# Altium project VESC_BMS.PrjPcb (part 2 of 2)
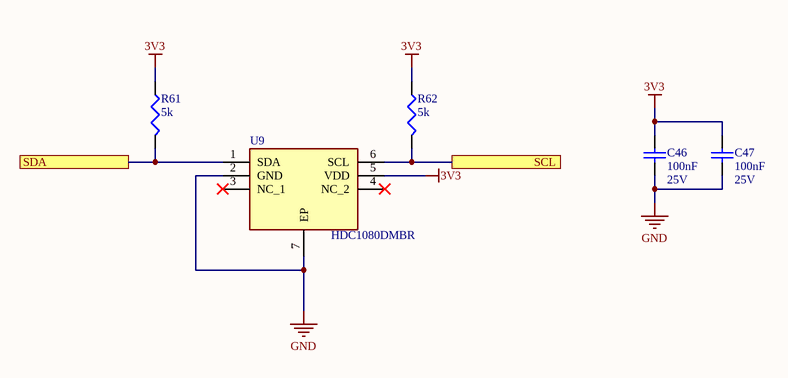
[diagram p9: HDC1080.SchDoc]

## Nets that join several sheets
3V3: BMS_TopLevel (J13.1 R46.1), Controller (15 pins), PowerSwitch (Q8.S R43.2), PowerManagement (C31.1 D3.1 L2.2 R29.2), CAN (C44.2 U7.5), HDC1080 (5 pins)
5V: BMS_TopLevel (Q9.S TP1.1 U6.1), BatteryStackMonitor (C3.1 R4.1 U1.48), PowerSwitch (C40.1 C41.2 IC1.1), PowerManagement (6 pins), CAN (C42.2 C43.2 U7.3), USBSerial (D12.2)
GND: BMS_TopLevel (24 pins), BatteryStackMonitor (19 pins), Battery stack monitor/CELL1 (C45_CELL1.1), Battery stack monitor/CELL2 (C45_CELL2.1), Battery stack monitor/CELL3 (C45_CELL3.1), Battery stack monitor/CELL4 (C45_CELL4.1), Battery stack monitor/CELL5 (C45_CELL5.1), Battery stack monitor/CELL6 (C45_CELL6.1), Battery stack monitor/CELL7 (C45_CELL7.1), Battery stack monitor/CELL8 (C45_CELL8.1), Battery stack monitor/CELL9 (C45_CELL9.1), Battery stack monitor/CELL10 (C45_CELL10.1), Battery stack monitor/CELL11 (C45_CELL11.1), Battery stack monitor/CELL12 (C45_CELL12.1), Battery stack monitor/CELL13 (C45_CELL13.1), Battery stack monitor/CELL14 (C45_CELL14.1), Battery stack monitor/CELL15 (C45_CELL15.1), Battery stack monitor/CELL16 (C45_CELL16.1), Battery stack monitor/CELL17 (C45_CELL17.1), Battery stack monitor/CELL18 (C45_CELL18.1), Controller (17 pins), PowerSwitch (18 pins), PowerManagement (21 pins), CAN (C42.1 C43.1 C44.1 U7.2), USBSerial (7 pins), HDC1080 (C46.1 C47.1 U9.2 U9.7)
BATT+: BMS_TopLevel (J1.1), BatteryStackMonitor (R1.1), PowerSwitch (D7.2 R32.0 R33.0 U5.2), PowerManagement (R20.1)
BT_EN: BMS_TopLevel (R47.1 R48.2), Controller (U2.53)
Buzzer: BMS_TopLevel (Q10.G R52.1), Controller (U2.17)
C1: BatteryStackMonitor (U1.36), Battery stack monitor/CELL1 (C45_CELL1.2 D13_CELL1.2 R58_CELL1.2), Battery stack monitor/CELL2 (D13_CELL2.1)
C2: BatteryStackMonitor (U1.34), Battery stack monitor/CELL2 (C45_CELL2.2 D13_CELL2.2 R58_CELL2.2), Battery stack monitor/CELL3 (D13_CELL3.1)
C3: BatteryStackMonitor (U1.32), Battery stack monitor/CELL3 (C45_CELL3.2 D13_CELL3.2 R58_CELL3.2), Battery stack monitor/CELL4 (D13_CELL4.1)
C4: BatteryStackMonitor (U1.30), Battery stack monitor/CELL4 (C45_CELL4.2 D13_CELL4.2 R58_CELL4.2), Battery stack monitor/CELL5 (D13_CELL5.1)
C5: BatteryStackMonitor (U1.28), Battery stack monitor/CELL5 (C45_CELL5.2 D13_CELL5.2 R58_CELL5.2), Battery stack monitor/CELL6 (D13_CELL6.1)
C6: BatteryStackMonitor (U1.26), Battery stack monitor/CELL6 (C45_CELL6.2 D13_CELL6.2 R58_CELL6.2), Battery stack monitor/CELL7 (D13_CELL7.1)
C7: BatteryStackMonitor (U1.24), Battery stack monitor/CELL7 (C45_CELL7.2 D13_CELL7.2 R58_CELL7.2), Battery stack monitor/CELL8 (D13_CELL8.1)
C8: BatteryStackMonitor (U1.22), Battery stack monitor/CELL8 (C45_CELL8.2 D13_CELL8.2 R58_CELL8.2), Battery stack monitor/CELL9 (D13_CELL9.1)
C9: BatteryStackMonitor (U1.20), Battery stack monitor/CELL9 (C45_CELL9.2 D13_CELL9.2 R58_CELL9.2), Battery stack monitor/CELL10 (D13_CELL10.1)
C10: BatteryStackMonitor (U1.18), Battery stack monitor/CELL10 (C45_CELL10.2 D13_CELL10.2 R58_CELL10.2), Battery stack monitor/CELL11 (D13_CELL11.1)
C11: BatteryStackMonitor (U1.16), Battery stack monitor/CELL11 (C45_CELL11.2 D13_CELL11.2 R58_CELL11.2), Battery stack monitor/CELL12 (D13_CELL12.1)
C12: BatteryStackMonitor (U1.14), Battery stack monitor/CELL12 (C45_CELL12.2 D13_CELL12.2 R58_CELL12.2), Battery stack monitor/CELL13 (D13_CELL13.1)
C13: BatteryStackMonitor (U1.12), Battery stack monitor/CELL13 (C45_CELL13.2 D13_CELL13.2 R58_CELL13.2), Battery stack monitor/CELL14 (D13_CELL14.1)
C14: BatteryStackMonitor (U1.10), Battery stack monitor/CELL14 (C45_CELL14.2 D13_CELL14.2 R58_CELL14.2), Battery stack monitor/CELL15 (D13_CELL15.1)
C15: BatteryStackMonitor (U1.8), Battery stack monitor/CELL15 (C45_CELL15.2 D13_CELL15.2 R58_CELL15.2), Battery stack monitor/CELL16 (D13_CELL16.1)
C16: BatteryStackMonitor (U1.6), Battery stack monitor/CELL16 (C45_CELL16.2 D13_CELL16.2 R58_CELL16.2), Battery stack monitor/CELL17 (D13_CELL17.1)
C17: BatteryStackMonitor (U1.4), Battery stack monitor/CELL17 (C45_CELL17.2 D13_CELL17.2 R58_CELL17.2), Battery stack monitor/CELL18 (D13_CELL18.1)
C18: BatteryStackMonitor (U1.2), Battery stack monitor/CELL18 (C45_CELL18.2 D13_CELL18.2 R58_CELL18.2)
CAN_RX: Controller (U2.61), CAN (U7.4)
CAN_TX: Controller (U2.62), CAN (U7.1)
CANH: BMS_TopLevel (J8.1), CAN (R53.2 U7.7)
CANL: BMS_TopLevel (J8.2), CAN (R53.1 U7.6)
ChargeEnable: Controller (U2.26), PowerSwitch (IC1.4 R44.1)
CM1: BatteryStackMonitor (R7.2), Battery stack monitor/CELL1 (D13_CELL1.1)
CN1: BMS_TopLevel (J12.10), BatteryStackMonitor (R3.2), Battery stack monitor/CELL1 (R60_CELL1.1)
CN2: BMS_TopLevel (J12.9), Battery stack monitor/CELL1 (Q11_CELL1.S R58_CELL1.1), Battery stack monitor/CELL2 (R60_CELL2.1)
CN3: BMS_TopLevel (J12.8), Battery stack monitor/CELL2 (Q11_CELL2.S R58_CELL2.1), Battery stack monitor/CELL3 (R60_CELL3.1)
CN4: BMS_TopLevel (J12.7), Battery stack monitor/CELL3 (Q11_CELL3.S R58_CELL3.1), Battery stack monitor/CELL4 (R60_CELL4.1)
CN5: BMS_TopLevel (J12.6), Battery stack monitor/CELL4 (Q11_CELL4.S R58_CELL4.1), Battery stack monitor/CELL5 (R60_CELL5.1)
CN6: BMS_TopLevel (J12.5), Battery stack monitor/CELL5 (Q11_CELL5.S R58_CELL5.1), Battery stack monitor/CELL6 (R60_CELL6.1)
CN7: BMS_TopLevel (J12.4), Battery stack monitor/CELL6 (Q11_CELL6.S R58_CELL6.1), Battery stack monitor/CELL7 (R60_CELL7.1)
CN8: BMS_TopLevel (J12.3), Battery stack monitor/CELL7 (Q11_CELL7.S R58_CELL7.1), Battery stack monitor/CELL8 (R60_CELL8.1)
CN9: BMS_TopLevel (J12.2), Battery stack monitor/CELL8 (Q11_CELL8.S R58_CELL8.1), Battery stack monitor/CELL9 (R60_CELL9.1)
CN10: BMS_TopLevel (J10.10 J12.1), Battery stack monitor/CELL9 (Q11_CELL9.S R58_CELL9.1), Battery stack monitor/CELL10 (R60_CELL10.1)
CN11: BMS_TopLevel (J10.9), Battery stack monitor/CELL10 (Q11_CELL10.S R58_CELL10.1), Battery stack monitor/CELL11 (R60_CELL11.1)
CN12: BMS_TopLevel (J10.8), Battery stack monitor/CELL11 (Q11_CELL11.S R58_CELL11.1), Battery stack monitor/CELL12 (R60_CELL12.1)
CN13: BMS_TopLevel (J10.7), Battery stack monitor/CELL12 (Q11_CELL12.S R58_CELL12.1), Battery stack monitor/CELL13 (R60_CELL13.1)
CN14: BMS_TopLevel (J10.6), Battery stack monitor/CELL13 (Q11_CELL13.S R58_CELL13.1), Battery stack monitor/CELL14 (R60_CELL14.1)
CN15: BMS_TopLevel (J10.5), Battery stack monitor/CELL14 (Q11_CELL14.S R58_CELL14.1), Battery stack monitor/CELL15 (R60_CELL15.1)
CN16: BMS_TopLevel (J10.4), Battery stack monitor/CELL15 (Q11_CELL15.S R58_CELL15.1), Battery stack monitor/CELL16 (R60_CELL16.1)
CN17: BMS_TopLevel (J10.3), Battery stack monitor/CELL16 (Q11_CELL16.S R58_CELL16.1), Battery stack monitor/CELL17 (R60_CELL17.1)
CN18: BMS_TopLevel (J10.2), Battery stack monitor/CELL17 (Q11_CELL17.S R58_CELL17.1), Battery stack monitor/CELL18 (R60_CELL18.1)
CP18: BMS_TopLevel (J10.1), Battery stack monitor/CELL18 (Q11_CELL18.S R58_CELL18.1)
LED_GREEN: BMS_TopLevel (R51.2), Controller (U2.52)
LED_RED: BMS_TopLevel (R50.2), Controller (U2.51)
LoadOut: BMS_TopLevel (J2.1), PowerSwitch (D8.2 Q5.D Q7.D R36.2)
MISO: BatteryStackMonitor (U1.54), Controller (R17.1 U2.22)
MOSI: BatteryStackMonitor (U1.53), Controller (U2.23)
NetC6_1: BatteryStackMonitor (C6.1 R11.2), Controller (U2.14)
NetC7_1: BatteryStackMonitor (C7.1 R13.2), Controller (U2.16)
NetC8_1: BatteryStackMonitor (C8.1 R15.2), Controller (U2.8)
NetC9_1: BatteryStackMonitor (C9.1 R9.2), Controller (U2.9)
NetC36_2: Controller (U2.10), PowerSwitch (C36.2 R36.1 R40.1)
NetC37_2: Controller (U2.11), PowerSwitch (C37.2 R41.2)
NetD4_2: BMS_TopLevel (J5.4), PowerManagement (D4.2)
NetJ6_2: BMS_TopLevel (J6.2), BatteryStackMonitor (R14.1 R15.1)
NetJ7_2: BMS_TopLevel (J7.2), BatteryStackMonitor (R10.1 R11.1)
NetJ9_2: BMS_TopLevel (J9.2), BatteryStackMonitor (R12.1 R13.1)
NetJ11_3: BMS_TopLevel (J11.3), Controller (U2.43)
NetJ11_4: BMS_TopLevel (J11.4), Controller (U2.42)
NetQ2_G: Controller (U2.24), PowerManagement (Q2.G R29.1 R31.2)
NetQ3_D: Controller (U2.25), PowerManagement (Q3.D)
NetR8_2: BatteryStackMonitor (R8.2), Controller (U2.57)
NetR10_2: BatteryStackMonitor (R10.2), Controller (U2.34)
NetR12_2: BatteryStackMonitor (R12.2), Controller (U2.39)
NetR14_2: BatteryStackMonitor (R14.2), Controller (U2.40)
NetR42_2: Controller (U2.58), PowerSwitch (R42.2)
NetR45_1: BMS_TopLevel (R45.1), Controller (U2.38)
NetR61_1: Controller (U2.33), HDC1080 (R61.1 U9.1)
NetR62_1: Controller (U2.30), HDC1080 (R62.1 U9.6)
NetU2_56: Controller (U2.56), CAN (U7.8)
PushButton: BMS_TopLevel (J5.2), PowerManagement (R28.2)
S1: BatteryStackMonitor (U1.37), Battery stack monitor/CELL1 (R59_CELL1.2)
S2: BatteryStackMonitor (U1.35), Battery stack monitor/CELL2 (R59_CELL2.2)
S3: BatteryStackMonitor (U1.33), Battery stack monitor/CELL3 (R59_CELL3.2)
S4: BatteryStackMonitor (U1.31), Battery stack monitor/CELL4 (R59_CELL4.2)
S5: BatteryStackMonitor (U1.29), Battery stack monitor/CELL5 (R59_CELL5.2)
S6: BatteryStackMonitor (U1.27), Battery stack monitor/CELL6 (R59_CELL6.2)
S7: BatteryStackMonitor (U1.25), Battery stack monitor/CELL7 (R59_CELL7.2)
S8: BatteryStackMonitor (U1.23), Battery stack monitor/CELL8 (R59_CELL8.2)
S9: BatteryStackMonitor (U1.21), Battery stack monitor/CELL9 (R59_CELL9.2)
S10: BatteryStackMonitor (U1.19), Battery stack monitor/CELL10 (R59_CELL10.2)
S11: BatteryStackMonitor (U1.17), Battery stack monitor/CELL11 (R59_CELL11.2)
S12: BatteryStackMonitor (U1.15), Battery stack monitor/CELL12 (R59_CELL12.2)
S13: BatteryStackMonitor (U1.13), Battery stack monitor/CELL13 (R59_CELL13.2)
S14: BatteryStackMonitor (U1.11), Battery stack monitor/CELL14 (R59_CELL14.2)
S15: BatteryStackMonitor (U1.9), Battery stack monitor/CELL15 (R59_CELL15.2)
S16: BatteryStackMonitor (U1.7), Battery stack monitor/CELL16 (R59_CELL16.2)
S17: BatteryStackMonitor (U1.5), Battery stack monitor/CELL17 (R59_CELL17.2)
S18: BatteryStackMonitor (U1.3), Battery stack monitor/CELL18 (R59_CELL18.2)
~{SS}: BatteryStackMonitor (U1.61), Controller (U2.20)
SCK: BatteryStackMonitor (U1.62), Controller (U2.21)
SWCLK: BMS_TopLevel (J13.3 R49.1), Controller (U2.49)
SWDIO: BMS_TopLevel (J13.2 R46.2), Controller (U2.46)
USB_DM: Controller (U2.44), USBSerial (R56.2)
USB_DP: Controller (U2.45), USBSerial (R55.2)

## Assembly variants
Production: not fitted C6 C8 C26 J15 L3 L4 MOD1 R39_CELL1 R39_CELL2 R39_CELL3 R39_CELL4 R39_CELL5 R39_CELL6 R39_CELL7 R39_CELL8 R39_CELL9 R39_CELL10 R39_CELL11 R39_CELL12 R64 R69 R71